# EAGLE schematic basic_health (EAGLE 8.2.2)
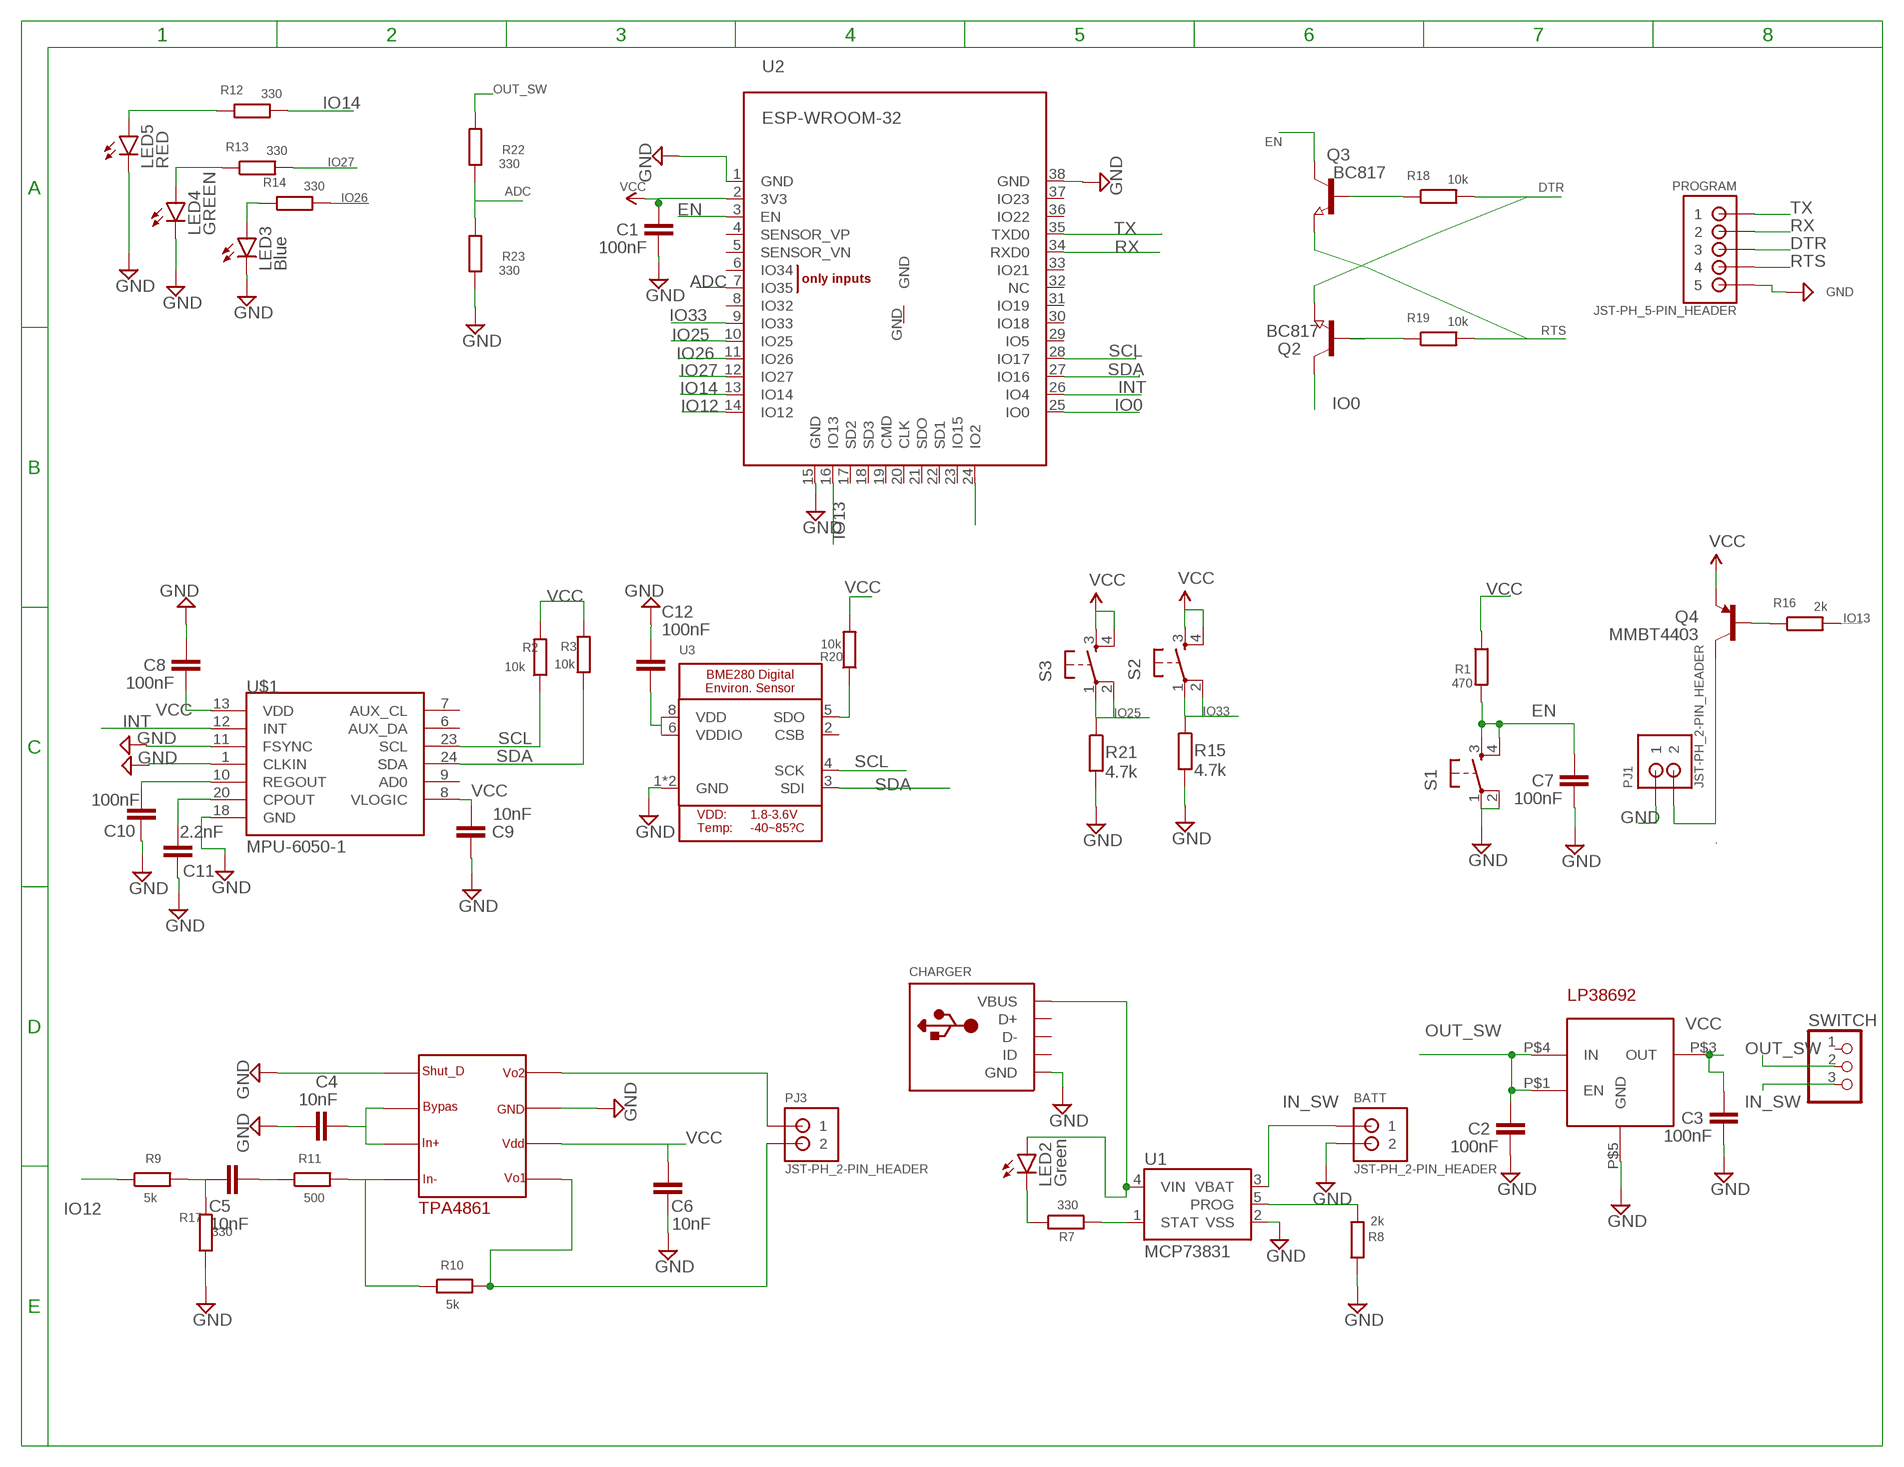
[diagram p0: schematic, sheet 1]

## Parts
BATT  JST-PH_2-PIN_HEADER  [JST_B2B-PH_HEADER]
C1  100nF  CAP0603-CAP  [0603-CAP]
C2  100nF  CAP0603-CAP  [0603-CAP]
C3  100nF  CAP0603-CAP  [0603-CAP]
C4  10nF  CAP0603-CAP  [0603-CAP]
C5  10nF  CAP0603-CAP  [0603-CAP]
C6  10nF  CAP0603-CAP  [0603-CAP]
C7  100nF  CAP0603-CAP  [0603-CAP]
C8  100nF  CAP0603-CAP  [0603-CAP]
C9  10nF  CAP0603-CAP  [0603-CAP]
C10  100nF  CAP0603-CAP  [0603-CAP]
C11  2.2nF  CAP0603-CAP  [0603-CAP]
C12  100nF  CAP0603-CAP  [0603-CAP]
CHARGER  USBMINIB  [USB-MINIB]
LED2  Green  LED-FKIT-1206  [FKIT-LED-1206]
LED3  Blue  LED-FKIT-1206  [FKIT-LED-1206]
LED4  GREEN  LED-FKIT-1206  [FKIT-LED-1206]
LED5  RED  LED-FKIT-1206  [FKIT-LED-1206]
PJ1  JST-PH_2-PIN_HEADER  [JST_B2B-PH_HEADER]
PJ3  JST-PH_2-PIN_HEADER  [JST_B2B-PH_HEADER]
PROGRAM  JST-PH_5-PIN_HEADER  [JST_B5B-PH_HEADER]
Q2  BC817  NPN-TRANSISTOR_SOT23  [SOT23]
Q3  BC817  NPN-TRANSISTOR_SOT23  [SOT23]
Q4  MMBT4403  TRANSISTOR_PNPMMBT4403  [SOT23-3]
R1  470  R-EU_R0805  [R0805]
R2  10k  R-EU_R0805  [R0805]
R3  10k  R-EU_R0805  [R0805]
R7  330  R-EU_R0805  [R0805]
R8  2k  R-EU_R0805  [R0805]
R9  5k  R-EU_R0805  [R0805]
R10  5k  R-EU_R0805  [R0805]
R11  500  R-EU_R0805  [R0805]
R12  330  R-EU_R0805  [R0805]
R13  330  R-EU_R0805  [R0805]
R14  330  R-EU_R0805  [R0805]
R15  4.7k  R-EU_R0805  [R0805]
R16  2k  R-EU_R0805  [R0805]
R17  330  R-EU_R0805  [R0805]
R18  10k  R-EU_R0805  [R0805]
R19  10k  R-EU_R0805  [R0805]
R20  10k  R-EU_R0805  [R0805]
R21  4.7k  R-EU_R0805  [R0805]
R22  330  R-EU_R0805  [R0805]
R23  330  R-EU_R0805  [R0805]
S1  TAC_SWITCHPTH  [TACTILE-PTH]
S2  TAC_SWITCHPTH  [TACTILE-PTH]
S3  TAC_SWITCHPTH  [TACTILE-PTH]
SWITCH  PINHD-1X3/90  [1X03/90]
U1  MCP73831  [SOT23-5]
U2  ESP-WROOM-32  [ESP-WROOM-32]
U3  BME280  [BME280]
U$1  MPU-6050-1  [QFN-24-4MM2]
U$2  TPA4861  [SOIC8]
U$3  LP38692_3.3V  [SOT-223-4]

## Nets
ADC: R22.1 R23.2 U2.7(IO35)
DTR: PROGRAM.P3 Q2.2(E) R18.2
EN: C7.1 Q3.3(C) R1.2 S1.3 S1.4 U2.3(EN)
GND: BATT.P2 C1.2 C2.2 C3.2 C4.2 C6.2 C7.2 C8.1 C9.1 C10.1 C11.1 C12.1 CHARGER.GND LED3.C LED4.C LED5.C PJ1.P1 PROGRAM.P5 R8.1 R15.2 R17.1 R21.2 R23.1 S1.1 S1.2 U1.2(VSS) U2.1(GND) U2.15(GND) U2.38(GND) U3.1(GND) U3.7(GND) U$1.1(CLKIN) U$1.11(FSYNC) U$1.18(GND) U$2.P$1 U$2.P$7 U$3.P$5(GND)
IN_SW: BATT.P1 SWITCH.3 U1.3(VBAT)
INT: U2.26(IO4) U$1.12(INT)
IO0: Q2.3(C) U2.25(IO0)
IO12: R9.1 U2.14(IO12)
IO13: R16.2 U2.16(IO13)
IO14: R12.2 U2.13(IO14)
IO25: R21.1 S3.1 S3.2 U2.10(IO25)
IO26: R14.2 U2.11(IO26)
IO27: R13.2 U2.12(IO27)
IO33: R15.1 S2.1 S2.2 U2.9(IO33)
N$1: C10.2 U$1.10(REGOUT)
N$2: C11.2 U$1.20(CPOUT)
N$3: PJ1.P2 Q4.3(C)
N$4: LED4.A R13.1
N$5: LED3.A R14.1
N$6: Q4.1(B) R16.1
N$7: CHARGER.VBUS LED2.A U1.4(VIN)
N$8: R10.1 R11.2 U$2.P$4
N$10: R7.2 U1.1(STAT)
N$11: PJ3.P2 R10.2 U$2.P$5
N$12: Q3.1(B) R18.1
N$13: Q2.1(B) R19.1
N$14: LED2.C R7.1
N$15: R8.2 U1.5(PROG)
N$16: C4.1 U$2.P$2 U$2.P$3
N$17: C5.1 R11.1
N$18: PJ3.P1 U$2.P$8
N$19: C5.2 R9.2 R17.2
N$20: LED5.A R12.1
N$21: R20.1 U3.5(SDO)
N$22: U2.24(IO2)
OUT_SW: C2.1 R22.2 SWITCH.2 U$3.P$1(EN) U$3.P$4(IN)
RTS: PROGRAM.P4 Q3.2(E) R19.2
RX: PROGRAM.P2 U2.34(RXD0)
SCL: R2.1 U2.28(IO17) U3.4(SCK) U$1.23(SCL)
SDA: R3.1 U2.27(IO16) U3.3(SDI) U$1.24(SDA)
TX: PROGRAM.P1 U2.35(TXD0)
VCC: C1.1 C3.1 C6.1 C8.2 C9.2 C12.2 Q4.2(E) R1.1 R2.2 R3.2 R20.2 S2.3 S2.4 S3.3 S3.4 U2.2(3V3) U3.6(VDDIO) U3.8(VDD) U$1.8(VLOGIC) U$1.13(VDD) U$2.P$6 U$3.P$3(OUT)
Unconnected: CHARGER.D+ CHARGER.D- CHARGER.ID SWITCH.1 U2.4(SENSOR_VP) U2.5(SENSOR_VN) U2.6(IO34) U2.8(IO32) U2.17(SD2) U2.18(SD3) U2.19(CMD) U2.20(CLK) U2.21(SDO) U2.22(SD1) U2.23(IO15) U2.29(IO5) U2.30(IO18) U2.31(IO19) U2.32(NC) U2.33(IO21) U2.36(IO22) U2.37(IO23) U2.GND U3.2(CSB) U$1.6(AUX_DA) U$1.7(AUX_CL) U$1.9(AD0)

## Library data of the parts
BATT PJ1 PJ3 = srg:JST-PH_2-PIN_HEADER: 2-pin JST PH Shrouded Header, top entry P/N B2B-PH-K-S Mating connector PHR-2 Mating cable assembly: Sparkfun PRT-09914 <http://www.sparkfun.com/products/9914>
C1-C12 = SparkFun-Passives:CAP: Capacitor Standard 0603 ceramic capacitor, and 0.1" leaded capacitor.
CHARGER = adafruit:USB: USB Connectors USBMINIB - Surface Mount Female Mini-B USB Connector 4UConnector: 06564 By microbuilder.eu Thru-hole RA Female Mini-B USB Connector 4UConnector: 18732 By ladyada.net
LED2-LED5 = SparkFun-LED:LED: LEDs Standard schematic elements and footprints for 5mm, 3mm, 1206, and 0603 sized LEDs. 5mm - Spark Fun Electronics SKU : COM-00529 (and others)
PROGRAM = srg:JST-PH_5-PIN_HEADER: 5-pin JST PH Shrouded Header, top entry P/N B5B-PH-K-S Mating connector PHR-5 Mating cable assembly: Sparkfun PRT-09917 <http://www.sparkfun.com/products/9917>
Q2 Q3 = semicon-smd-ipc:NPN-TRANSISTOR_: NPN TRANSISTOR
Q4 = SparkFun-DiscreteSemi:TRANSISTOR_PNP: Generic PNP BJT Double check pinouts against datasheets- not all devices are the same! MMBT3906 - 40V 200mA SOT-23 (TRANS-08052) MMBT4403 - 40V 600mA SOT-23 (TRANS-09245); PROD_ID: TRANS-09245
R1-R3 R7-R23 = resistor:R-EU_: RESISTOR, European symbol
S1-S3 = SparkFun-Retired:TAC_SWITCH: Momentary Switch Button commonly used for reset or general input. Spark Fun Electronics SKU : COM-00097 SMT- SWCH-08247
SWITCH = pinhead:PINHD-1X3: PIN HEADER
U1 = SparkFun-PowerIC:MCP73831: Miniature single cell, fully integrated Li-Ion, Li-polymer charge management controller http://ww1.microchip.com/downloads/en/DeviceDoc/20001984g.pdf IC-09995; PROD_ID: IC-09995
U2 = esp32:ESP-WROOM-32
U3 = BMP280:BME280: BME280 - Environmental Sensor (I2C + SPI)
U$1 = mpu6050:MPU-6050
U$2 = TPA4861:TPA4861
U$3 = LP38692:LP38692_3.3V